# Altium schematic sheet RF_Connect.SchDoc
size A3; SheetNumber: 3; SheetTotal: 3
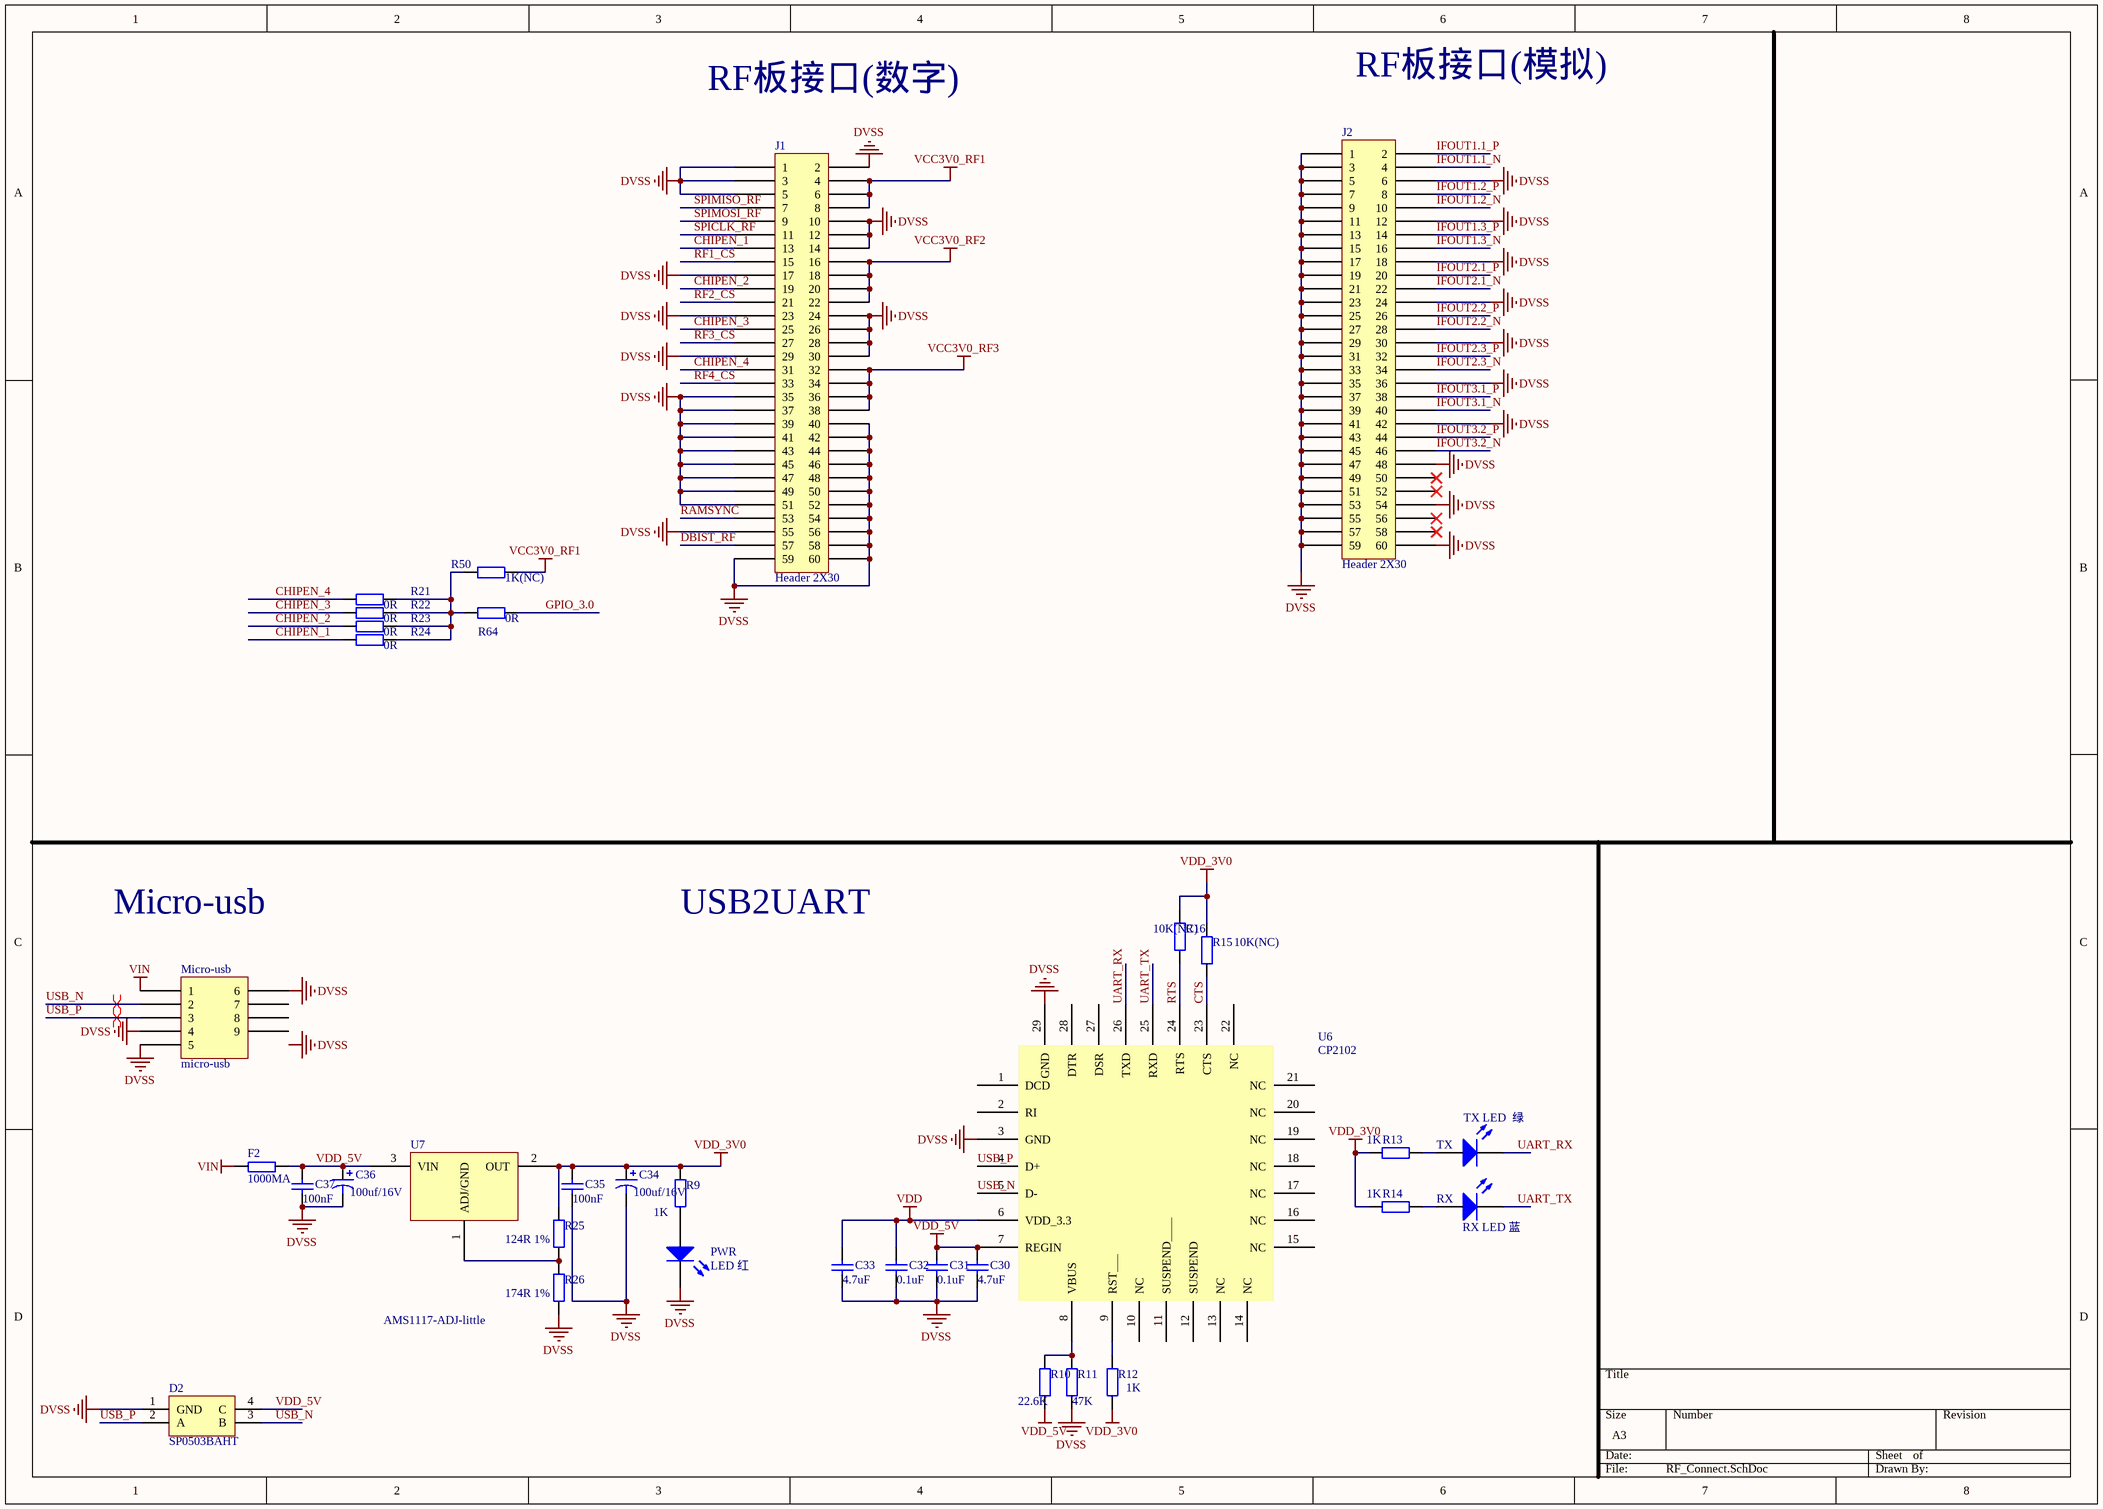
[diagram p0: RF_Connect.SchDoc]

## Parts
C30  4.7uF  [R0603]
C31  0.1uF  [R0603]
C32  0.1uF  [R0603]
C33  4.7uF  [R0603]
C34  100uf/16V  [TAN3528]
C35  100nF  [R0603]
C36  100uf/16V  [TAN3528]
C37  100nF  [R0603]
D2  SP0503BAHT  [SOT143]
F2  1000MA  [0805]
J1  Header 2X30  [60pin_0.8mm]
J2  Header 2X30  [60pin_0.8mm]
Micro-usb  micro-usb  [Micro-B]
PWR  LED 红  [LC-0603_LED_S4]
R9  1K  [R0603]
R10  22.6K  [R0603]
R11  47K  [R0603]
R12  1K  [R0603]
R13  1K  [R0603]
R14  1K  [R0603]
R15  10K(NC)  [R0603]
R16  10K(NC)  [R0603]
R21  0R  [R0603]
R22  0R  [R0603]
R23  0R  [R0603]
R24  0R  [R0603]
R25  124R 1%  [R0603]
R26  174R 1%  [R0603]
R50  1K(NC)  [R0603]
R64  0R  [R0603]
RX  RX LED 蓝  [LC-0603_LED_S4]
TX  TX LED  绿  [LC-0603_LED_S4]
U6  CP2102  [QFN28N5X5P0.5E3.35]
U7  AMS1117-ADJ-little  [LDO-SOT-89-3]

## Nets
DVSS: C30.2 C31.2 C32.2 C33.2 C34.2 C35.1 C36.2 C37.1 D2.1(GND) J1.1 J1.2 J1.3 J1.5 J1.10 J1.12 J1.14 J1.17 J1.23 J1.24 J1.26 J1.28 J1.29 J1.30 J1.35 J1.37 J1.39 J1.40 J1.41 J1.42 J1.43 J1.44 J1.45 J1.46 J1.47 J1.48 J1.49 J1.50 J1.51 J1.52 J1.54 J1.55 J1.56 J1.58 J1.59 J1.60 J2.1 J2.3 J2.5 J2.6 J2.7 J2.9 J2.11 J2.12 J2.13 J2.15 J2.17 J2.18 J2.19 J2.21 J2.23 J2.24 J2.25 J2.27 J2.29 J2.30 J2.31 J2.33 J2.35 J2.36 J2.37 J2.39 J2.41 J2.42 J2.43 J2.45 J2.47 J2.48 J2.49 J2.51 J2.53 J2.54 J2.55 J2.57 J2.59 J2.60 Micro-usb.4 Micro-usb.5 Micro-usb.6 PWR.2(K) R11.2 R26.1 U6.3(GND) U6.29(GND)
VCC3V0_RF1: J1.4 J1.6 J1.8 R50.2
VCC3V0_RF2: J1.16 J1.18 J1.20 J1.22
VCC3V0_RF3: J1.32 J1.34 J1.36 J1.38
VDD: C32.1 C33.1 U6.6(VDD_3.3)
VDD_3V0: C34.1 C35.2 R9.1 R12.2 R13.2 R14.2 R15.1 R16.1 R25.2 U7.2(OUT)
VDD_5V: C30.1 C31.1 C36.1 C37.2 D2.4(C) F2.2 R10.2 U6.7(REGIN) U7.3(VIN)
VIN: F2.1 Micro-usb.1
CHIPEN_1: J1.13 R24.1
CHIPEN_2: J1.19 R23.1
CHIPEN_3: J1.25 R22.1
CHIPEN_4: J1.31 R21.1
CTS: R15.2 U6.23(CTS)
DBIST_RF: J1.57
GPIO_3.0: R64.2
IFOUT1.1_N: J2.4
IFOUT1.1_P: J2.2
IFOUT1.2_N: J2.10
IFOUT1.2_P: J2.8
IFOUT1.3_N: J2.16
IFOUT1.3_P: J2.14
IFOUT2.1_N: J2.22
IFOUT2.1_P: J2.20
IFOUT2.2_N: J2.28
IFOUT2.2_P: J2.26
IFOUT2.3_N: J2.34
IFOUT2.3_P: J2.32
IFOUT3.1_N: J2.40
IFOUT3.1_P: J2.38
IFOUT3.2_N: J2.46
IFOUT3.2_P: J2.44
RAMSYNC: J1.53
RF1_CS: J1.15
RF2_CS: J1.21
RF3_CS: J1.27
RF4_CS: J1.33
RTS: R16.2 U6.24(RTS)
SPICLK_RF: J1.11
SPIMISO_RF: J1.7
SPIMOSI_RF: J1.9
UART_RX: TX.2(K) U6.26(TXD)
UART_TX: RX.2(K) U6.25(RXD)
USB_N: D2.3(B) Micro-usb.2 U6.5(D-)
USB_P: D2.2(A) Micro-usb.3 U6.4(D+)
NetPWR_1: PWR.1(A) R9.2
NetR10_1: R10.1 R11.1 U6.8(VBUS)
NetR12_1: R12.1 U6.9(RST___)
NetR13_1: R13.1 TX.1(A)
NetR14_1: R14.1 RX.1(A)
NetR21_2: R21.2 R22.2 R23.2 R24.2 R50.1 R64.1
NetR25_1: R25.1 R26.2 U7.1(ADJ/GND)

Not connected (* = marked no-connect by the designer): J2 50* 52* 56* 58*; Micro-usb 7 8 9; U6 1(DCD) 2(RI) 10(NC) 11(SUSPEND____) 12(SUSPEND) 13(NC) 14(NC) 15(NC) 16(NC) 17(NC) 18(NC) 19(NC) 20(NC) 21(NC) 22(NC) 27(DSR) 28(DTR)

## Layout directives
differential pair: USB_N, USB_P

## Notes on the sheet
- RF板接口(数字)
- RF板接口(模拟)
- Micro-usb
- USB2UART
- Labels drawn without touching a wire or pin: DVSS

## Library data of the parts
C30-C33 = Cap: 表贴电容; Value: 1uF; Published: 8-Jun-2000; LatestRevisionDate: 17-Jul-2002; LatestRevisionNote: Re-released for DXP Platform.; PackageReference: RAD-0.3; Publisher: Altium Limited
C34 C36 = Cap Pol1: tan3528 100uf/16V; Value: 100pF; Published: 8-Jun-2000; LatestRevisionDate: 17-Jul-2002; LatestRevisionNote: Re-released for DXP Platform.; PackageReference: RB7.6-15; Publisher: Altium Limited; PackageDescription: Polarized Capacitor (Radial); 2 Leads
C35 C37 = Cap: Value: 100pF; Published: 8-Jun-2000; LatestRevisionDate: 17-Jul-2002; LatestRevisionNote: Re-released for DXP Platform.; PackageReference: RAD-0.3; Publisher: Altium Limited
D2 = SP0503BAHT: 表贴芯片
F2 = R_1: 表贴保险
J1 J2 = Header 2X30: 2x30 ， 60P， 0.8mm ，立贴 ，母
Micro-usb = Micro-B
PWR RX TX = LED-SMT: 表贴LED管
R9 R12-R14 = Res2: 表贴电阻; Published: 8-Jun-2000; LatestRevisionDate: 17-Jul-2002; LatestRevisionNote: Re-released for DXP Platform.; PackageReference: AXIAL-0.4; Publisher: Altium Limited; Value: 1K
R10 R11 R15 R16 = Res2: 表贴电阻; Value: 1K; Published: 8-Jun-2000; LatestRevisionDate: 17-Jul-2002; LatestRevisionNote: Re-released for DXP Platform.; PackageReference: AXIAL-0.4; Publisher: Altium Limited
R21-R24 R50 R64 = Res2: Resistor; Manufacturer: Generic Components; Class: Passive; Value: 2.2K; Published: 08/06/2000; Publisher: Altium Hobart Technology Centre; SubClass: Resistor
R25 R26 = Res2: Value: 1K; Published: 8-Jun-2000; LatestRevisionDate: 17-Jul-2002; LatestRevisionNote: Re-released for DXP Platform.; PackageReference: AXIAL-0.4; Publisher: Altium Limited; PackageDescription: Axial Device, Thru-Hole; 2 Leads; 0.4 in Pin Spacing
U6 = Component_2: 表贴芯片
U7 = AMS1117-ADJ-little: AMS1117-ADJ-little ，SOT-89-3